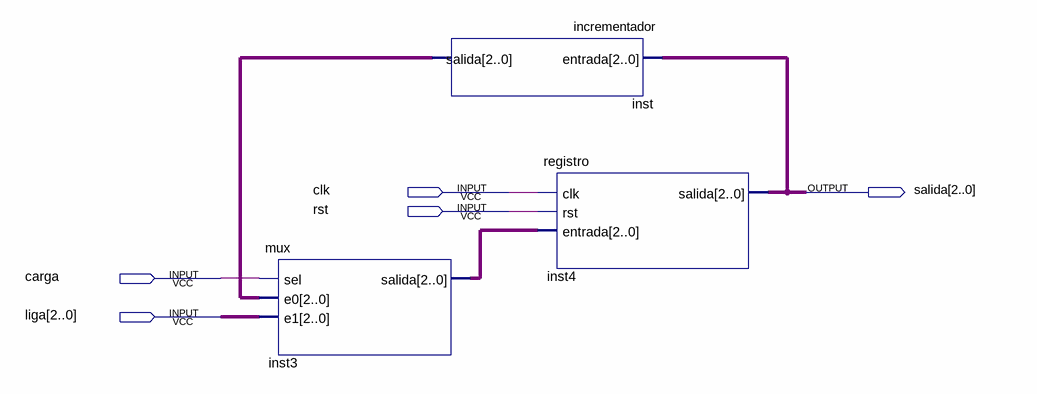
[diagram p0: schematic sheet]
// Quartus schematic contador.bdf as structural Verilog: 3 symbols, 5 pins
module contador (
  input  clk,
  input  rst,
  input  carga,
  input  [2:0] liga,
  output [2:0] salida
);

  wire [2:0] inst3_salida, inst_salida;

  mux inst3 (.sel(carga), .e0(inst_salida), .e1(liga), .salida(inst3_salida));
  incrementador inst (.entrada(salida), .salida(inst_salida));
  registro inst4 (.clk(clk), .rst(rst), .entrada(inst3_salida), .salida(salida));
endmodule
